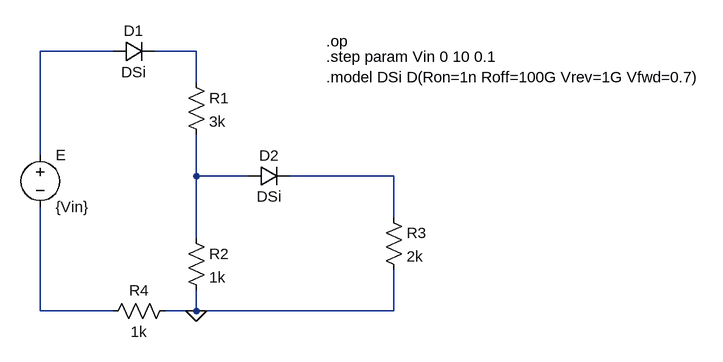
[diagram p0: schematic LucasSantosdeLuccaExercicio13.asc]
LucasSantosdeLuccaExercicio13.asc, the LTspice schematic file:
Version 4
SHEET 1 1132 680
WIRE 176 0 64 0
WIRE 304 0 240 0
WIRE 304 48 304 0
WIRE 64 160 64 0
WIRE 304 192 304 128
WIRE 384 192 304 192
WIRE 608 192 448 192
WIRE 608 256 608 192
WIRE 304 288 304 192
WIRE 64 400 64 240
WIRE 176 400 64 400
WIRE 304 400 304 368
WIRE 304 400 256 400
WIRE 608 400 608 336
WIRE 608 400 304 400
FLAG 304 400 0
SYMBOL voltage 64 144 R0
SYMATTR InstName E
SYMATTR Value {Vin}
SYMBOL diode 176 16 R270
WINDOW 0 32 32 VTop 2
WINDOW 3 0 32 VBottom 2
SYMATTR InstName D1
SYMATTR Value DSi
SYMBOL diode 384 208 R270
WINDOW 0 32 32 VTop 2
WINDOW 3 0 32 VBottom 2
SYMATTR InstName D2
SYMATTR Value DSi
SYMBOL res 288 32 R0
SYMATTR InstName R1
SYMATTR Value 3k
SYMBOL res 288 272 R0
SYMATTR InstName R2
SYMATTR Value 1k
SYMBOL res 592 240 R0
SYMATTR InstName R3
SYMATTR Value 2k
SYMBOL res 272 384 R90
WINDOW 0 0 56 VBottom 2
WINDOW 3 32 56 VTop 2
SYMATTR InstName R4
SYMATTR Value 1k
TEXT 504 8 Left 2 !.step param Vin 0 10 0.1
TEXT 504 -16 Left 2 !.op
TEXT 504 40 Left 2 !.model DSi D(Ron=1n Roff=100G Vrev=1G Vfwd=0.7)

The netlist it stands for:
* LucasSantosdeLuccaExercicio13.asc
V§E N001 N005 {Vin}
D1 N001 N002 DSi
D2 N003 N004 DSi
R1 N002 N003 3k
R2 N003 0 1k
R3 N004 0 2k
R4 0 N005 1k
.model D D
.lib standard.dio
.step param Vin 0 10 0.1
.op
.model DSi D(Ron=1n Roff=100G Vrev=1G Vfwd=0.7)
.backanno
.end